# Altium project Node.PrjPcb
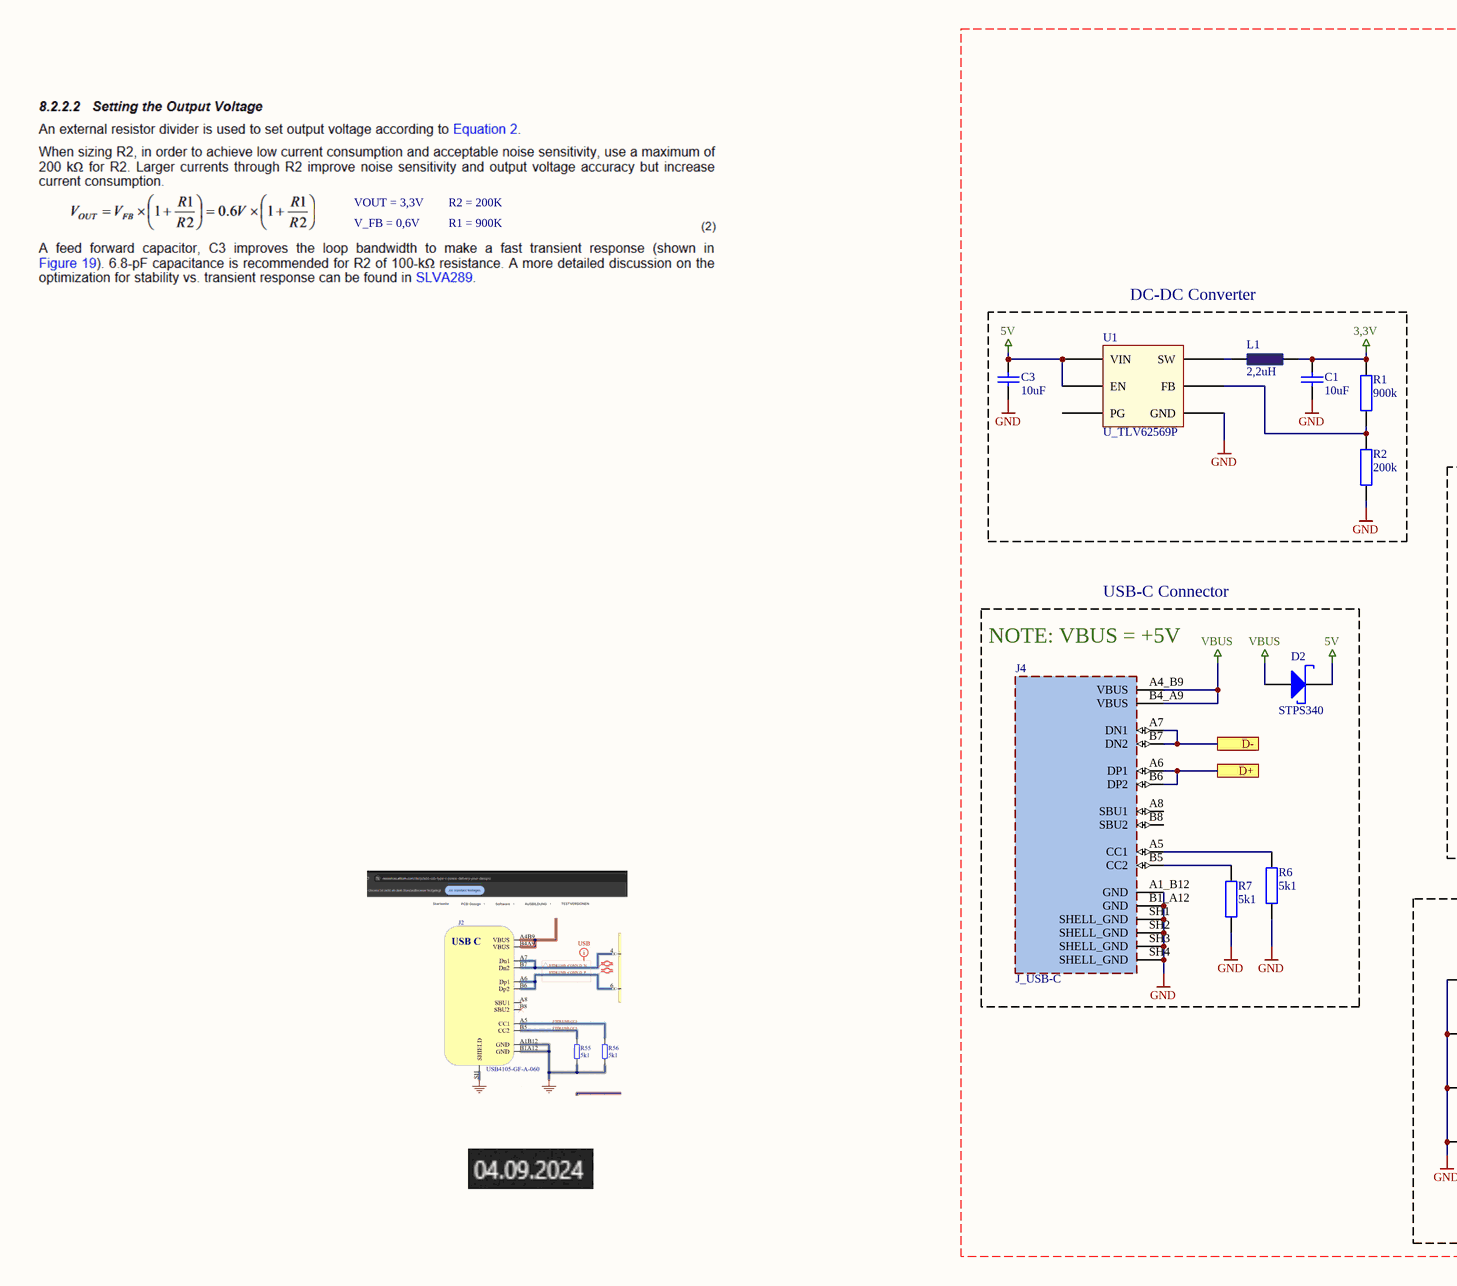
[diagram p0: Sheet1.SchDoc, left]
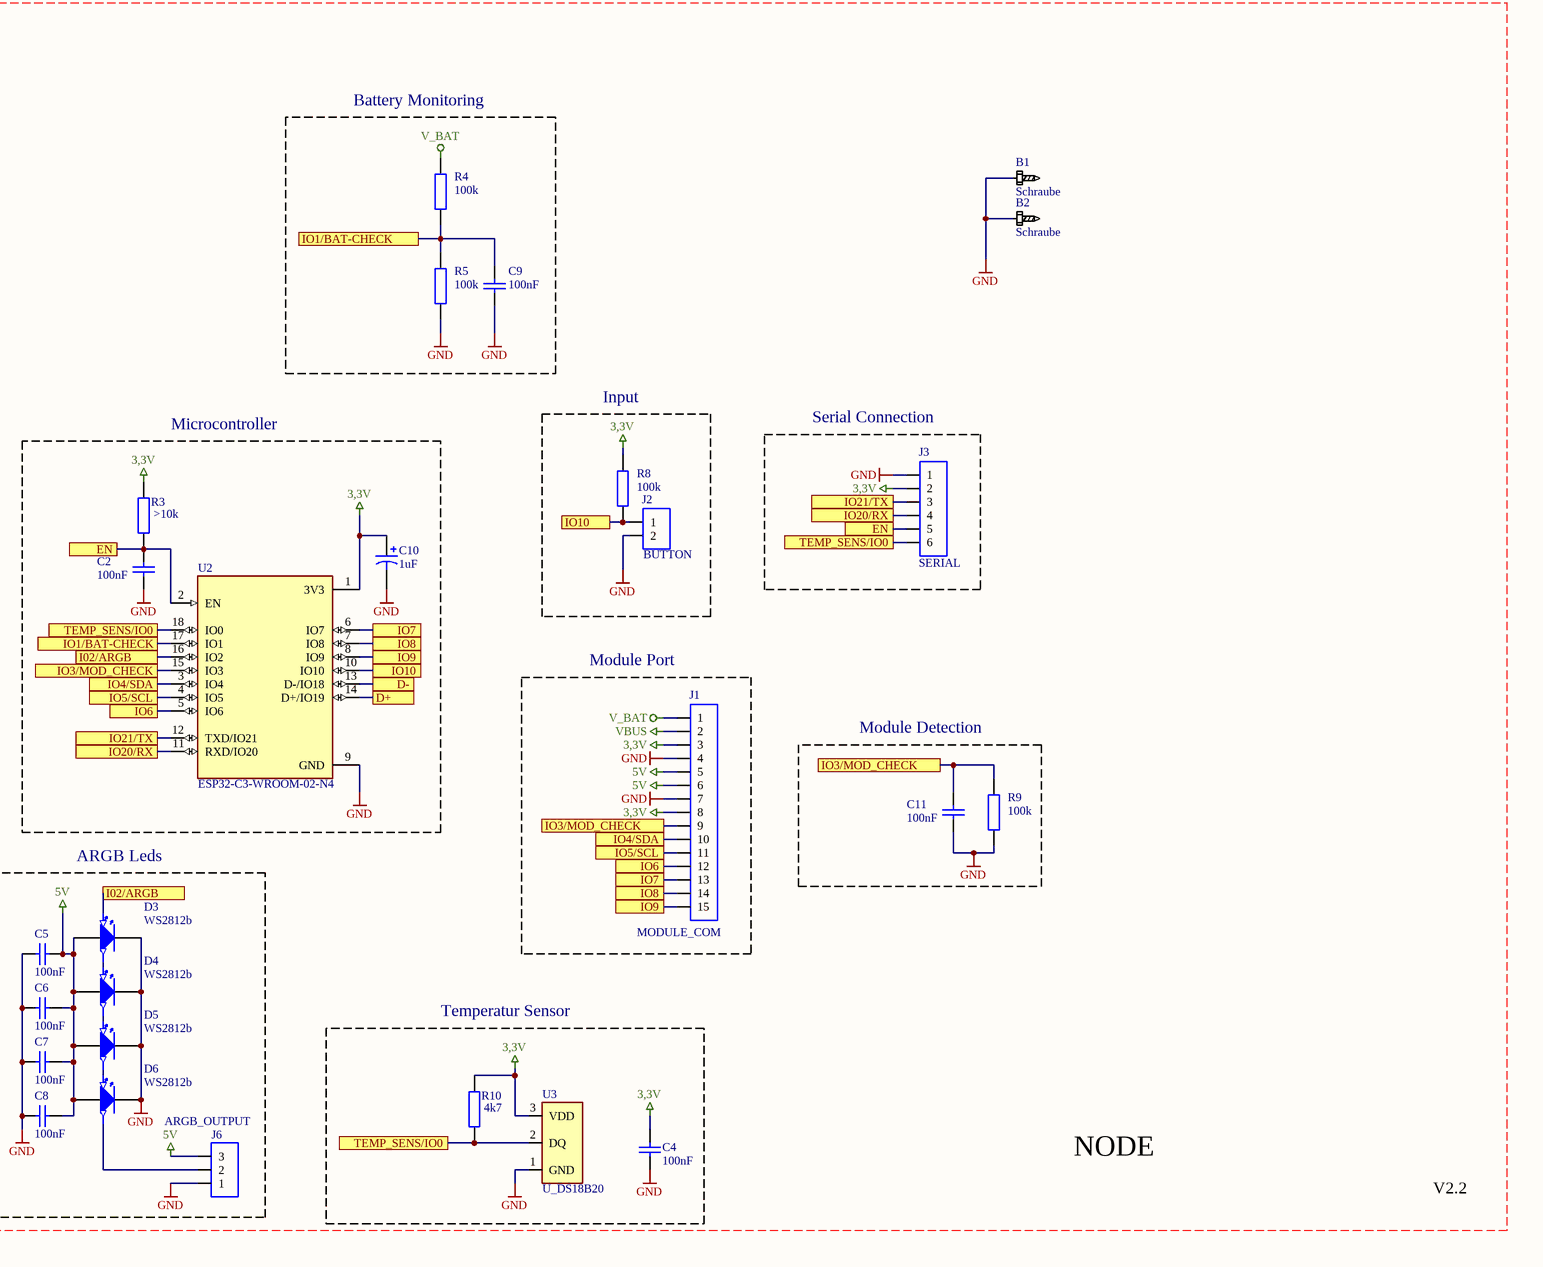
[diagram p1: Sheet1.SchDoc, right]
1 sheet, 37 parts. Net scope: flat (ports and power ports of the same name join across sheets).
Board file: PCB1.PcbDoc

## Sheet Sheet1.SchDoc: NODE
size 381 x 241 mm; Date: 22.10.2024; Author: RK; DrawnBy: RK; Engineer: RK; Revision: V2.2; SheetNumber: 1; SheetTotal: 1

### Parts
B1  Schraube  [B_Schraube-M3 PAD]
B2  Schraube  [B_Schraube-M3 PAD]
C1  10uF  [C_SMD_0805]
C2  100nF  [C_SMD_0603]
C3  10uF  [C_SMD_0805]
C4  100nF  [C_SMD_0603]
C5  100nF  [C_SMD_0603]
C6  100nF  [C_SMD_0603]
C7  100nF  [C_SMD_0603]
C8  100nF  [C_SMD_0603]
C9  100nF  [C_SMD_0603]
C10  1uF  [C_SMD_0805]
C11  100nF  [C_SMD_0603]
D2  STPS340  [D_DO-221]
D3  WS2812b  [D_SMD_LED-ARGB]
D4  WS2812b  [D_SMD_LED-ARGB]
D5  WS2812b  [D_SMD_LED-ARGB]
D6  WS2812b  [D_SMD_LED-ARGB]
J1  MODULE_COM  [SIP-15]
J2  BUTTON  [SIP-2]
J3  SERIAL  [SIP-6]
J4  J_USB-C  [GCT_USB4105-GF-A]
J6  ARGB_OUTPUT  [Sip-3]
L1  2,2uH  [L_SMD_ND_NR3015T2R2M]
R1  900k  [R_SMD_0603]
R2  200k  [R_SMD_0603]
R3  >10k  [R_SMD_0805]
R4  100k  [R_SMD_0805]
R5  100k  [R_SMD_0805]
R6  5k1  [R_SMD_0805]
R7  5k1  [R_SMD_0805]
R8  100k  [R_SMD_0805]
R9  100k  [R_SMD_0805]
R10  4k7  [R_SMD_0603]
U1  U_TLV62569P  [SOT50P160X60-6N]
U2  ESP32-C3-WROOM-02-N4  [MODULE_ESP32-C3-WROOM-02-H4]
U3  U_DS18B20  [TO-92_DS18B20]

### Blocks framed on the sheet
Battery Monitoring: C9 R4 R5
DC-DC Converter: C1 C3 L1 R1 R2 U1
Input: J2 R8
Microcontroller: C2 C10 R3 U2
Serial Connection: J3
NOTE: VBUS = +5V: D2 J4 R6 R7
Module Port: J1
Module Detection: C11 R9
ARGB Leds: C5-C8 D3-D6 J6
Temperatur Sensor: C4 R10 U3

### Ports
D+ (see Sheet1[1C]), D+ (see Sheet1[3C]), D- (see Sheet1[1C]), D- (see Sheet1[3C]), EN (see Sheet1[2B]), EN (see Sheet1[4B]), I02/ARGB (see Sheet1[2C]), IO1/BAT-CHECK (see Sheet1[2C]), IO1/BAT-CHECK (see Sheet1[3A]), IO3/MOD_CHECK (see Sheet1[2C], Sheet1[4C]), IO3/MOD_CHECK (see Sheet1[4C]), IO4/SDA (see Sheet1[2C]), IO4/SDA (see Sheet1[4C]), IO5/SCL (see Sheet1[2C]), IO5/SCL (see Sheet1[4C]), IO6 (see Sheet1[2C]), IO6 (see Sheet1[4C]), IO7 (see Sheet1[3C]), IO7 (see Sheet1[4C]), IO8 (see Sheet1[3C]), IO8 (see Sheet1[4C]), IO9 (see Sheet1[3C]), IO9 (see Sheet1[4C]), IO10 (see Sheet1[3C]), IO10 (see Sheet1[4B]), IO20/RX (see Sheet1[2C]), IO20/RX (see Sheet1[4B]), IO21/TX (see Sheet1[2C]), IO21/TX (see Sheet1[4B]), TEMP_SENS/IO0 (see Sheet1[2C], Sheet1[3D]), TEMP_SENS/IO0 (see Sheet1[2C], Sheet1[4B]), TEMP_SENS/IO0 (see Sheet1[3D], Sheet1[4B])

### Nets
3,3V: C1.1 C4.1 C10.1 J1.3 J1.8 J3.2 L1.1 R1.1 R3.2 R8.2 R10.2 U2.1(3V3) U3.3(VDD)
5V: C3.1 C5.2 C6.2 C7.2 C8.2 D2.2(K) D3.1(VDD) D4.1(VDD) D5.1(VDD) D6.1(VDD) J1.5 J1.6 J6.3 U1.3(VIN) U1.5(EN)
GND: B1.1(PAD) B2.1(PAD) C1.2 C2.1 C3.2 C4.2 C5.1 C6.1 C7.1 C8.1 C9.1 C10.2 C11.1 D3.3(GND) D4.3(GND) D5.3(GND) D6.3(GND) J1.4 J1.7 J2.2 J3.1 J4.A1_B12(GND) J4.B1_A12(GND) J4.SH1(SHELL_GND) J4.SH2(SHELL_GND) J4.SH3(SHELL_GND) J4.SH4(SHELL_GND) J6.1 R2.2 R5.1 R6.1 R7.1 R9.1 U1.2(GND) U2.9(GND) U3.1(GND)
V_BAT: J1.1 R4.2
VBUS: D2.1(A) J1.2 J4.A4_B9(VBUS) J4.B4_A9(VBUS)
NetC2_2: C2.2 J3.5 R3.1 U2.2(EN) ; port EN
NetC9_2: C9.2 R4.1 R5.2 U2.17(IO1) ; port IO1/BAT-CHECK
NetC11_2: C11.2 J1.9 R9.2 U2.15(IO3) ; port IO3/MOD_CHECK
NetD3_2: D3.2(DOUT) D4.4(DIN)
NetD3_4: D3.4(DIN) U2.16(IO2) ; port I02/ARGB
NetD4_2: D4.2(DOUT) D5.4(DIN)
NetD5_2: D5.2(DOUT) D6.4(DIN)
NetD6_2: D6.2(DOUT) J6.2
NetJ1_10: J1.10 U2.3(IO4) ; port IO4/SDA
NetJ1_11: J1.11 U2.4(IO5) ; port IO5/SCL
NetJ1_12: J1.12 U2.5(IO6) ; port IO6
NetJ1_13: J1.13 U2.6(IO7) ; port IO7
NetJ1_14: J1.14 U2.7(IO8) ; port IO8
NetJ1_15: J1.15 U2.8(IO9) ; port IO9
NetJ2_1: J2.1 R8.1 U2.10(IO10) ; port IO10
NetJ3_3: J3.3 U2.12(TXD/IO21) ; port IO21/TX
NetJ3_4: J3.4 U2.11(RXD/IO20) ; port IO20/RX
NetJ3_6: J3.6 R10.1 U2.18(IO0) U3.2(DQ) ; port TEMP_SENS/IO0
NetJ4_A5: J4.A5(CC1) R6.2
NetJ4_A6: J4.A6(DP1) J4.B6(DP2) U2.14(D+/IO19) ; port D+
NetJ4_A7: J4.A7(DN1) J4.B7(DN2) U2.13(D-/IO18) ; port D-
NetJ4_B5: J4.B5(CC2) R7.2
NetL1_2: L1.2 U1.4(SW)
NetR1_2: R1.2 R2.1 U1.1(FB)

Not connected (* = marked no-connect by the designer): J4 A8(SBU1) B8(SBU2); U1 6(PG)

### Notes on the sheet
- VOUT = 3,3V
- V_FB = 0,6V
- R2 = 200K
- R1 = 900K
- USB-C Connector

### Library data of the parts
B1 B2 = B_Schraube: Schraubenloch für M3 Schrauben
C1-C9 C11 = C_SMD_KO: Kondensator SMD Universal, Keramik, Folie, usw.; Spannung: *; Bauform: *; Typ: *
C10 = C_SMD_Tantal: Tantalkondensator
D2 = D_SMD_Schottky: Diode SMD Schottky; Spannung Rev.: 0,4V; Spannung For.: *; Strom: *
D3-D6 = D_SMD_LED-ARGB: Diode SMD ARGB
J1 = J_THT_CON15: Stecker
J2 = J_THT_CON2: Stecker
J3 = J_THT_CON6: Stecker
J4 = J_USB-C: USB4105-GF-; MF: {'manufacturer': u'GCT'}; MP: USB4105-GF-A; Package: None; Price: None; Value: *; Availability: Unavailable
J6 = J_THT_CON3: Stecker
L1 = L_SMD_Spule: Spule SMD
R1-R10 = R_SMD_Widerstand: Widerstand SMD
U2 = ESP32-C3-WROOM-02-N4: WiFi Modules (802.11) (Engineering Samples) SMD module, ESP32-C3, 4MB SPI flash, PCB antenna, -40 C +85 C; MF: Espressif Systems; Value: *; SnapEDA_Link: https://www.snapeda.com/parts/ESP32-C3-WROOM-02-N4/Espressif+Systems/view-part/?ref=snap; Purchase-URL: https://pricing.snapeda.com/search/part/ESP32-C3-WROOM-02-N4/?ref=eda; Availability: In Stock; Price: None; Package: Package; Check_prices: https://www.snapeda.com/parts/ESP32-C3-WROOM-02-N4/Espressif+Systems/view-part/?ref=eda; MP: ESP32-C3-WROOM-02-N4
U3 = U_DS18B20: Temperature Sensor Digital, Local -55Â°C ~ 125Â°C 12 b 8-uMAX-EP¦8-uSOP-EP; MF: Maxim; Value: *; SnapEDA_Link: https://www.snapeda.com/parts/DS18B20/Maxim+Integrated/view-part/?ref=snap; Purchase-URL: https://pricing.snapeda.com/search/part/DS18B20/?ref=eda; Availability: In Stock; Price: None; Package: TO-226-3 Maxim; Check_prices: https://www.snapeda.com/parts/DS18B20/Maxim+Integrated/view-part/?ref=eda; MP: DS18B20